# EasyEDA Pro project ProPrj_F411SoundBoard_2026-02-11.epro, schematic F411SoundBoard
Board Name: Board1; Create Date: 2025-06-15; Page Name: F411SoundBoard; Project Name: F411SoundBoard; Schematic Name: F411SoundBoard; Update Date: 2025-06-17; Page Size: A4; Version: V1.0
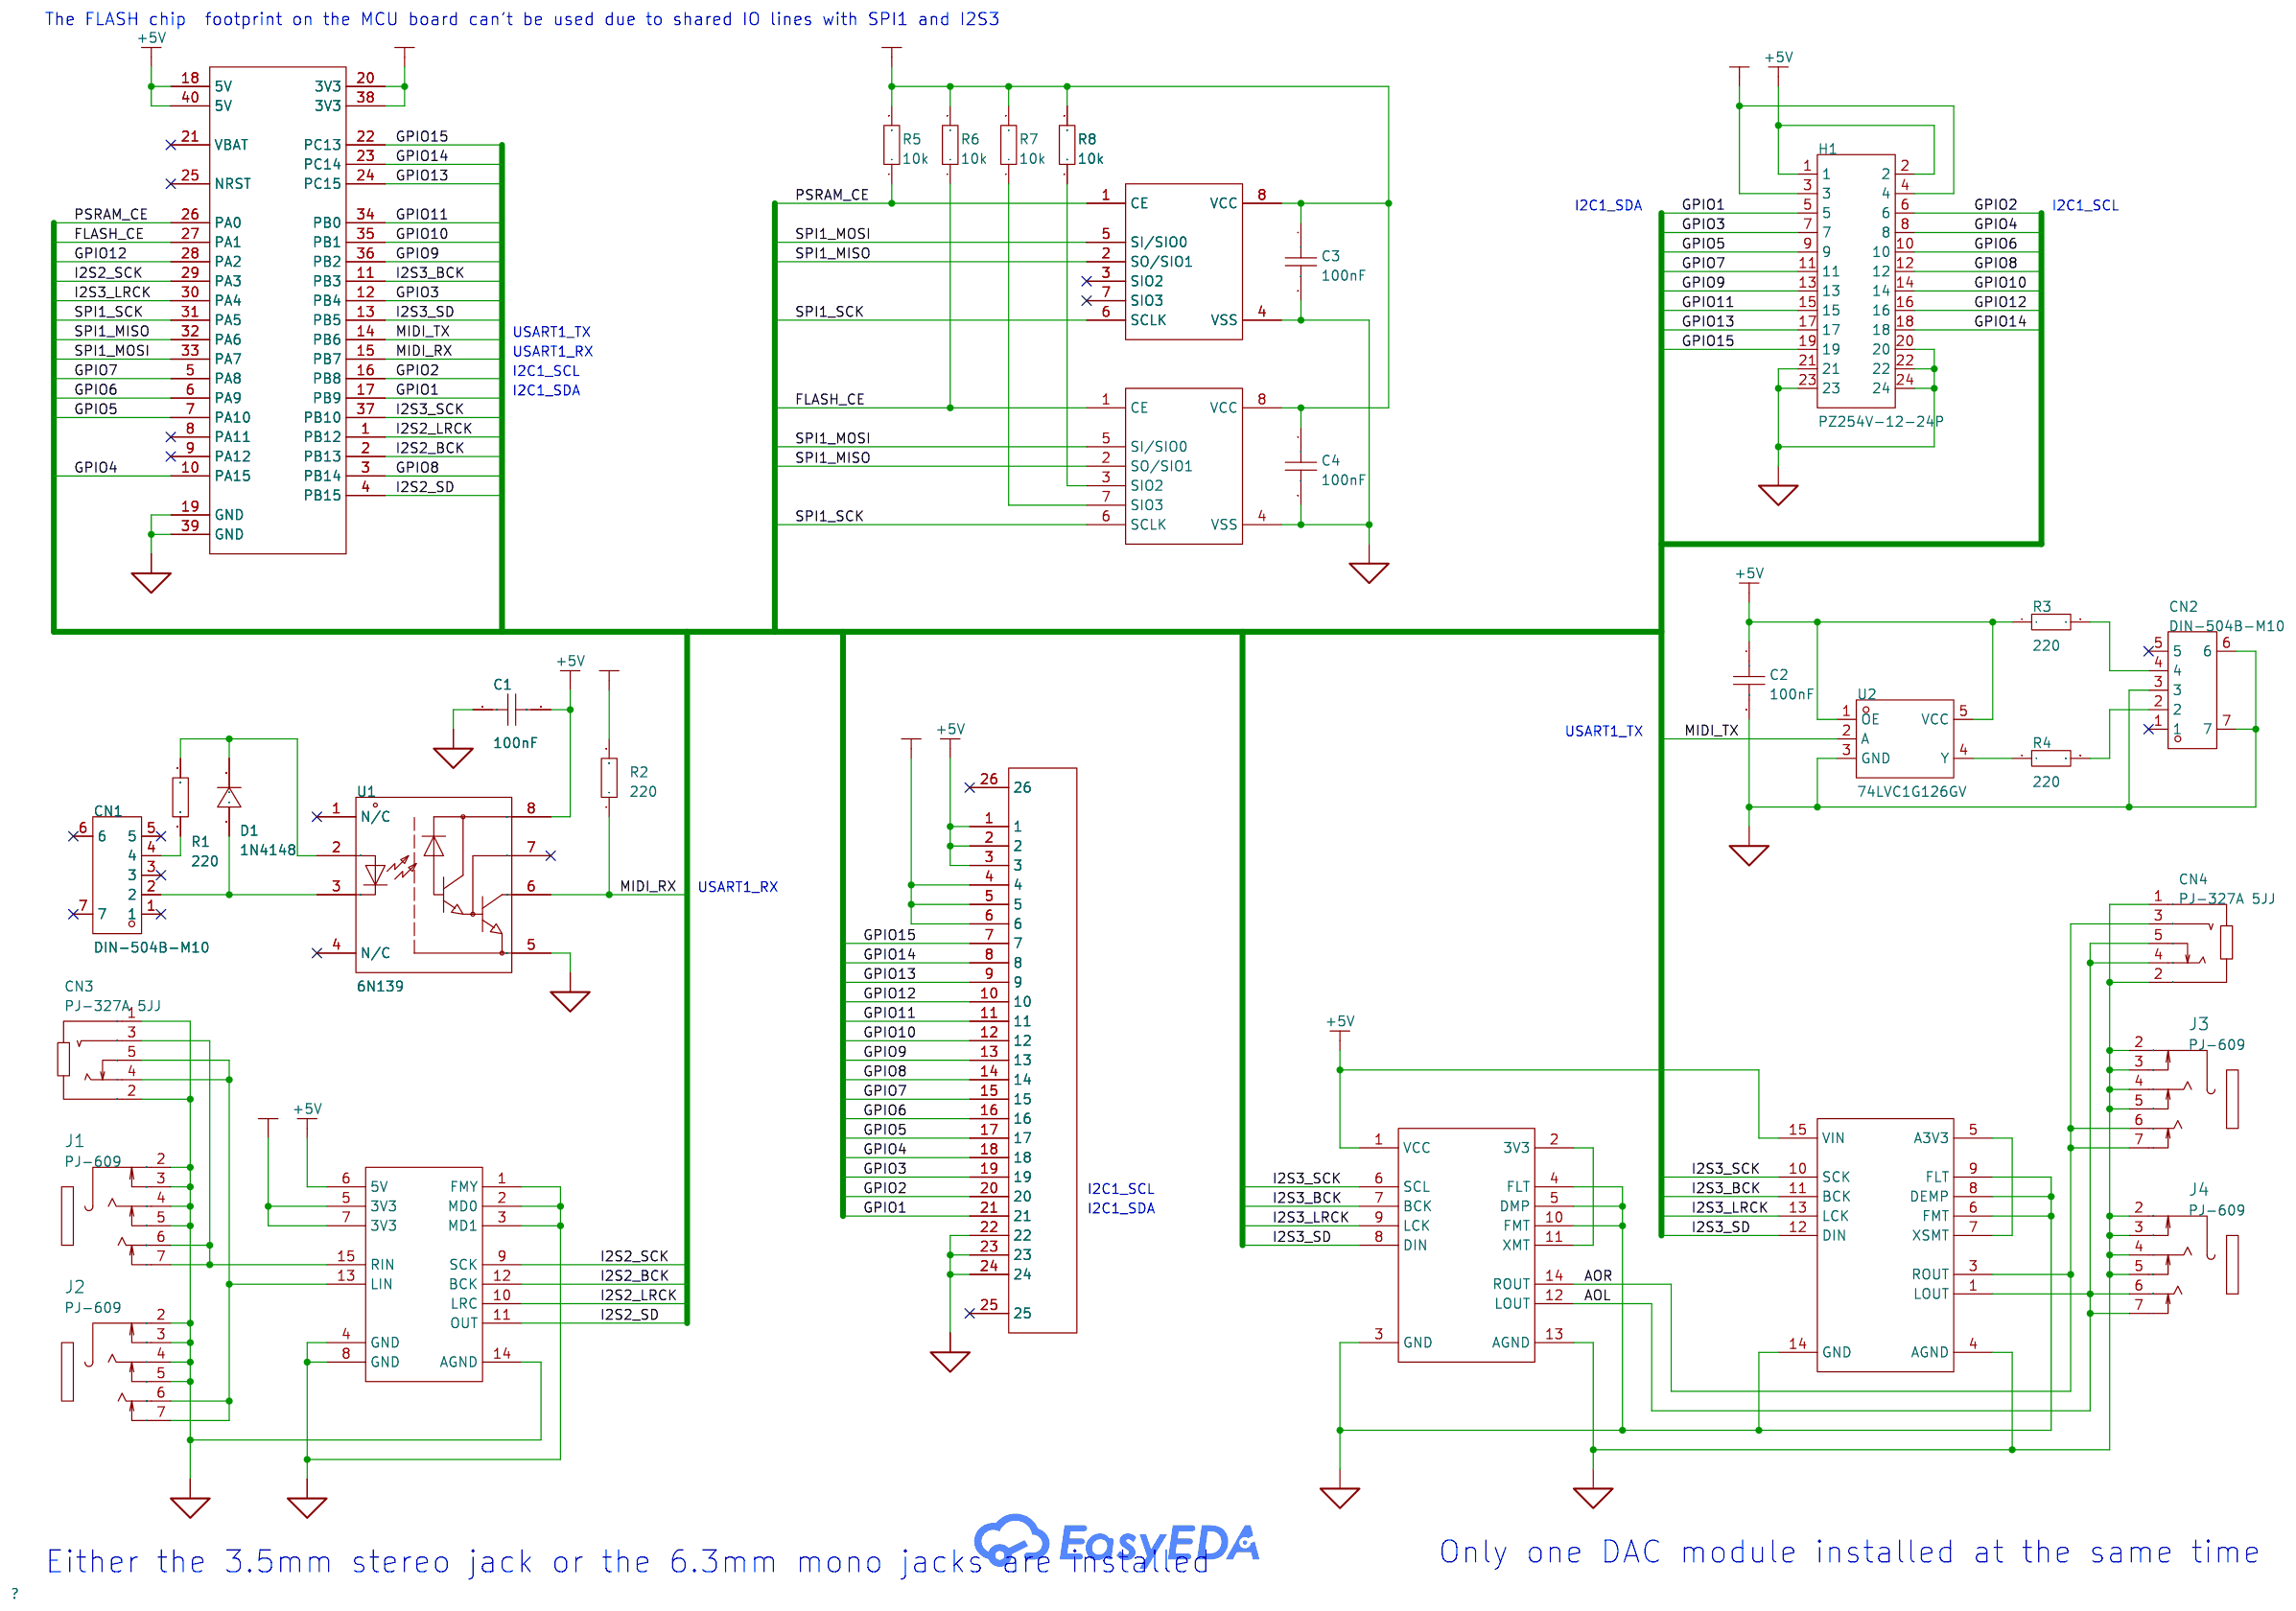
[diagram p0: schematic sheet]

## Parts
C1  100nF  [CAP-TH_L5.5-W2.4-P5.08-D0.6]
C2  100nF  [C0805]
C3  100nF  [C0805]
C4  100nF  [C0805]
CN1  DIN-504B-M10  [CONN-TH_DIN-504B-M10]
CN2  DIN-504B-M10  [CONN-TH_DIN-504B-M10]
CN3  PJ-327A 5JJ  [AUDIO-SMD_PJ-327A5JJ]
CN4  PJ-327A 5JJ  [AUDIO-SMD_PJ-327A5JJ]
D1  1N4148  [DO-35_BD2.0-L4.0-P8.00-D0.5-FD]
FPC1  AFC01-S24FCA-00  [FPC-SMD_24P-P0.50_AFC01-S24FCA-00]
H1  PZ254V-12-24P  [HDR-TH_24P-P2.54-V-M-R2-C12-S2.54]
J1  PJ-609  [AUDIO-TH_PJ-609]
J2  PJ-609  [AUDIO-TH_PJ-609]
J3  PJ-609  [AUDIO-TH_PJ-609]
J4  PJ-609  [AUDIO-TH_PJ-609]
M1  Blackpill F411  [Module_20x2_600mil]
M5  PCM1808  [PCM1808_ADC_MODULE]
M6  PCM5102  [WCMCU-5102]
M7  PCM5102  [PCM5102_MODULE]
R1  10kΩ  [R_AXIAL-0.4]
R2  10kΩ  [R_AXIAL-0.4]
R3  10kΩ  [R0805]
R4  10kΩ  [R0805]
R5  10kΩ  [R0805]
R6  10kΩ  [R0805]
R7  10kΩ  [R0805]
R8  10kΩ  [R0805]
U1  6N139  [DIP-8_L9.6-W6.4-P2.54-LS7.9-BL]
U2  74LVC1G126GV  [SOT-753_L3.1-W1.7-P0.95-LS3.0-BR]
U3  PSRAM 8MB  [SOP-8_L5.3-W5.2-P1.27-LS7.9-BL]
U4  W25Q128JVSIQ  [SOIC-8_L5.3-W5.3-P1.27-LS8.0-BL]

## Library data of the parts
C1 = CC1H104ZC1FD3F5O1100: Capacitance: Tolerance:-20%~+80% Tolerance:-20%~+80% Voltage Rated: Lead Spacing: Temperature Coefficient: φD: Body Thickness:2.4mm; LCSC Part Name: 100nF -20%~+80% 50V; Supplier Part: C2832508; Manufacturer: Dersonic(德尔创); Supplier Footprint: 插件,P=5.08mm; JLCPCB Part Class: Extended Part; Datasheet: https://atta.szlcsc.com/upload/public/pdf/source/20211027/6BE094CC11F3C85D18CFEA066D7024CD.pdf; Supplier: LCSC; Tolerance: -20%~+80%; Body Thickness: 2.4mm
C2-C4 = CAP_0603: Supplier Footprint: 0603
CN1 CN2 = DIN-504B-M10: Supplier Part: C2939346; Manufacturer: HOOYA(皓宇电子); Supplier Footprint: 插件; JLCPCB Part Class: Extended Part; Datasheet: https://atta.szlcsc.com/upload/public/pdf/source/20220120/ABB2570656C6359DBC61E5C1017AC323.pdf; Supplier: LCSC
CN3 CN4 = PJ-327A 5JJ: Connector Type:3.5mm Headphone Jack Current Rating (Max):500mA Voltage Rating (Max):30V Contact Material:Copper Contact Plating:Gold Operating Temperature Range:-30℃~+70℃ Operating Temperature Range:-30℃~+70℃; LCSC Part Name: 3.5mm耳机座; Supplier Part: C668605; Manufacturer: SHOU HAN(首韩); Supplier Footprint: SMD; JLCPCB Part Class: Extended Part; Datasheet: https://atta.szlcsc.com/upload/public/pdf/source/20200618/C668605_9C1065207AFEF8C715B1238987CF5F80.pdf; Supplier: LCSC; Connector Type: 3.5mm Headphone Jack; Current Rating (Max): 500mA; Voltage Rating (Max): 30V; Contact Material: Copper; Contact Plating: Gold; Operating Temperature Range: -30℃~+70℃
D1 = 1N4148_C258182: Diode Configuration:- Voltage - Forward(Vf@If):1V@10mA Voltage - DC Reverse(Vr):100V Current - Rectified:200mA Reverse Leakage Current (Ir):5uA@75V Reverse Recovery Time (trr):4ns Operating Temperature:-55℃~+175℃@(Tj) Operating Temperature:-55℃~+175℃@(Tj); Supplier Part: C258182; Manufacturer: onsemi(安森美); Supplier Footprint: DO-35; JLCPCB Part Class: Extended Part; Datasheet: https://atta.szlcsc.com/upload/public/pdf/source/20180829/C258182_3EE2D0AB6109C1B72B054FC50B8BC8AD.pdf; Supplier: LCSC; Voltage - Forward(Vf@If): 1V@10mA; Voltage - DC Reverse(Vr): 100V; Current - Rectified: 200mA; Reverse Leakage Current (Ir): 5uA@75V; Reverse Recovery Time (trr): 4ns; Operating Temperature: -55℃~+175℃@(Tj)
FPC1 = PC_AFC01-S24FCA-00: Locking Feature:Flip type Contact Type:Bottom Contact Number of Contacts:24P Pitch:0.5mm Mounting Type:Horizontal attachment FFC, FCB Thickness:0.3mm FFC, FCB Thickness:0.3mm Height Above Board:2mm; LCSC Part Name: 间距:0.5mm P数:24P 翻盖式 下接; Supplier Part: C262669; Manufacturer: JS(钜硕电子); Supplier Footprint: SMD,P=0.5mm,卧贴; JLCPCB Part Class: Extended Part; Datasheet: https://atta.szlcsc.com/upload/public/pdf/source/20190816/C413942_2A72D1AC756EAE17EEDF756A339D4500.pdf; Supplier: LCSC; Locking Feature: Flip type; Contact Type: Bottom Contact; Number of Contacts: 24P; Pitch: 0.5mm; Mounting Type: Horizontal attachment; FFC, FCB Thickness: 0.3mm; Height Above Board: 2mm
H1 = PZ254V-12-24P: Pin Structure:2x12P Pitch:2.54mm Row Spacing:2.54mm Circluar Pins/Square Pins:Policy Mounting Type:Straight Number of Rows:Double Row Number of Pins:24P Current Rating:- Voltage Rating (Max):- Length of Mating Pin:6mm Insulation Height:2.5mm Length of End; LCSC Part Name: 2x12P 间距:2.54mm 方针 直插; Supplier Part: C492429; Manufacturer: XFCN(兴飞); Supplier Footprint: 插件,P=2.54mm; JLCPCB Part Class: Extended Part; Datasheet: https://atta.szlcsc.com/upload/public/pdf/source/20200309/C492429_A90DEF30FD4D9CDC2C3DDFC5EAF9C00B.pdf; Supplier: LCSC; Pin Structure: 2x12P; Pitch: 2.54mm; Row Spacing: 2.54mm; Circluar Pins/Square Pins: Policy; Mounting Type: Straight; Number of Rows: Double Row; Number of Pins: 24P; Length of Mating Pin: 6mm; Insulation Height: 2.5mm; Length of End Connection Pin: 3mm; Contact Material: Brass; Operating Temperature: -40℃~+105℃; Color: Black
J1-J4 = PJ-609: Connector Type:6.35mm耳机座 Current Rating (Max):1A Voltage Rating (Max):50V Operating Temperature Range:-20℃~+70℃ Operating Temperature Range:-20℃~+70℃; LCSC Part Name: 6.35mm耳机座 两件套; Supplier Part: C309274; Manufacturer: HOOYA(皓宇电子); Supplier Footprint: 插件; JLCPCB Part Class: Extended Part; Datasheet: https://atta.szlcsc.com/upload/public/pdf/source/20181226/C309274_AB77CFAA40746E22EC2996DC68F300B9.pdf; Supplier: LCSC; Connector Type: 6.35mm耳机座; Current Rating (Max): 1A; Voltage Rating (Max): 50V; Operating Temperature Range: -20℃~+70℃
M1 = BlackPill_F411: STM32F411 based MCU module
M5 = PCM1808_ADC_Module: PCM1808 based ADC audio input module
M6 = WCMCU-5102: A PCM5102 based audio DAC module
M7 = PCM5102_Module: PCM5102 based audio DAC module
R1-R8 = Res_AXIAL-1/8W: Supplier Footprint: Through
U1 = 6N139_C5224104: Forward Voltage:1.4V Output Current:60mA Isolation Voltage(rms):5300V Number of Outputs:1 Operating Temperature:-55℃~+100℃ Operating Temperature:-55℃~+100℃; Supplier Part: C5224104; Manufacturer: VISHAY(威世); Supplier Footprint: DIP-8; JLCPCB Part Class: Extended Part; Datasheet: https://atta.szlcsc.com/upload/public/pdf/source/20221031/1E5B59C0BBF2E24895420015CB89D7D7.pdf; Supplier: LCSC; Forward Voltage: 1.4V; Output Current: 60mA; Isolation Voltage(rms): 5300V; Number of Outputs: 1; Operating Temperature: -55℃~+100℃
U2 = 74LVC1G126GV: Supplier Part: C703586; Manufacturer: Nexperia(安世); Supplier Footprint: SOT-753; JLCPCB Part Class: Extended Part; Datasheet: https://atta.szlcsc.com/upload/public/pdf/source/20200715/C703586_E6345225E39094214D3CD308CDCA878C.pdf; Supplier: LCSC
U3 U4 = ESP_PSRAM64: 8MB of psuedo static random access memory with SPI in 8 pin small outline package

## Nets
3V3: C3.1 C4.1 FPC1.4 FPC1.5 FPC1.6 H1.3 H1.4 M1.20(3V3) M1.38(3V3) M5.5(3V3) M5.7(3V3) R2.2 R5.2 R6.2 R7.2 R8.2 U3.8(VCC) U4.8(VCC)
+5V: C1.2 C2.1 FPC1.1 FPC1.2 FPC1.3 H1.1 H1.2 M1.18(5V) M1.40(5V) M5.6(5V) M6.1(VCC) M7.15(VIN) R3.1 U1.8(VCC) U2.1(OE) U2.5(VCC)
GND: C1.1 C2.2 C3.2 C4.2 CN2.3 CN2.6 CN2.7 FPC1.22 FPC1.23 FPC1.24 H1.20 H1.21 H1.22 H1.23 H1.24 M1.19(GND) M1.39(GND) M5.1(FMY) M5.2(MD0) M5.3(MD1) M5.4(GND) M5.8(GND) M6.3(GND) M6.4(FLT) M6.5(DMP) M6.10(FMT) M7.6(FMT) M7.8(DEMP) M7.9(FLT) M7.14(GND) U1.5(GND) U2.3(GND) U3.4(VSS) U4.4(VSS)
AIGND: CN3.1 CN3.2 J1.2 J1.3 J1.4 J1.5 J2.2 J2.3 J2.4 J2.5 M5.14(AGND)
AOGND: CN4.1 CN4.2 J3.2 J3.3 J3.4 J3.5 J4.2 J4.3 J4.4 J4.5 M6.13(AGND) M7.4(AGND)
AOL: CN4.4 CN4.5 J4.6 J4.7 M6.12(LOUT) M7.1(LOUT)
AOR: CN4.3 J3.6 J3.7 M6.14(ROUT) M7.3(ROUT)
FLASH_CE: M1.27(PA1) R6.1 U4.1(CE)
GPIO1: FPC1.21 H1.5 M1.17(PB9)
GPIO2: FPC1.20 H1.6 M1.16(PB8)
GPIO3: FPC1.19 H1.7 M1.12(PB4)
GPIO4: FPC1.18 H1.8 M1.10(PA15)
GPIO5: FPC1.17 H1.9 M1.7(PA10)
GPIO6: FPC1.16 H1.10 M1.6(PA9)
GPIO7: FPC1.15 H1.11 M1.5(PA8)
GPIO8: FPC1.14 H1.12 M1.3(PB14)
GPIO9: FPC1.13 H1.13 M1.36(PB2)
GPIO10: FPC1.12 H1.14 M1.35(PB1)
GPIO11: FPC1.11 H1.15 M1.34(PB0)
GPIO12: FPC1.10 H1.16 M1.28(PA2)
GPIO13: FPC1.9 H1.17 M1.24(PC15)
GPIO14: FPC1.8 H1.18 M1.23(PC14)
GPIO15: FPC1.7 H1.19 M1.22(PC13)
I2S2_BCK: M1.2(PB13) M5.12(BCK)
I2S2_LRCK: M1.1(PB12) M5.10(LRC)
I2S2_SCK: M1.29(PA3) M5.9(SCK)
I2S2_SD: M1.4(PB15) M5.11(OUT)
I2S3_BCK: M1.11(PB3) M6.7(BCK) M7.11(BCK)
I2S3_LRCK: M1.30(PA4) M6.9(LCK) M7.13(LCK)
I2S3_SCK: M1.37(PB10) M6.6(SCL) M7.10(SCK)
I2S3_SD: M1.13(PB5) M6.8(DIN) M7.12(DIN)
MIDI_RX: M1.15(PB7) R2.1 U1.6(VO)
MIDI_TX: M1.14(PB6) U2.2(A)
PSRAM_CE: M1.26(PA0) R5.1 U3.1(CE)
SPI1_MISO: M1.32(PA6) U3.2(SO/SIO1) U4.2(SO/SIO1)
SPI1_MOSI: M1.33(PA7) U3.5(SI/SIO0) U4.5(SI/SIO0)
SPI1_SCK: M1.31(PA5) U3.6(SCLK) U4.6(SCLK)
$1N8448: D1.2(K) R1.1 U1.2(VF+)
$1N8617: R4.1 U2.4(Y)
$1N9304: CN1.4 R1.2
$1N9313: CN1.2 D1.1(A) U1.3(VF-)
$1N9335: CN2.4 R3.2
$1N9340: CN2.2 R4.2
$1N10058: M6.2(3V3) M6.11(XMT)
$1N10064: M7.5(A3V3) M7.7(XSMT)
$1N10608: CN3.3 J1.6 J1.7 M5.15(RIN)
$1N10635: CN3.4 CN3.5 J2.6 J2.7 M5.13(LIN)
$1N21996: R8.1 U4.3(SIO2)
$1N22001: R7.1 U4.7(SIO3)

Not connected (* = marked no-connect by the designer): CN1 1* 3* 5* 6* 7*; CN2 1* 5*; FPC1 25* 26*; M1 8(PA11)* 9(PA12)* 21(VBAT)* 25(NRST)*; U1 1(N/C)* 4(N/C)* 7(VB)*; U3 3(SIO2)* 7(SIO3)*

## Notes on the sheet
- The FLASH chip  footprint on the MCU board can't be used due to shared IO lines with SPI1 and I2S3
- I2C1_SDA
- I2C1_SCL
- USART1_TX
- USART1_RX
- I2C1_SCL
- I2C1_SDA
- USART1_TX
- USART1_RX
- I2C1_SCL
- I2C1_SDA
- Either the 3.5mm stereo jack or the 6.3mm mono jacks are installed
- Only one DAC module installed at the same time
